# EAGLE schematic Projeto 2 (EAGLE 9.3.0)
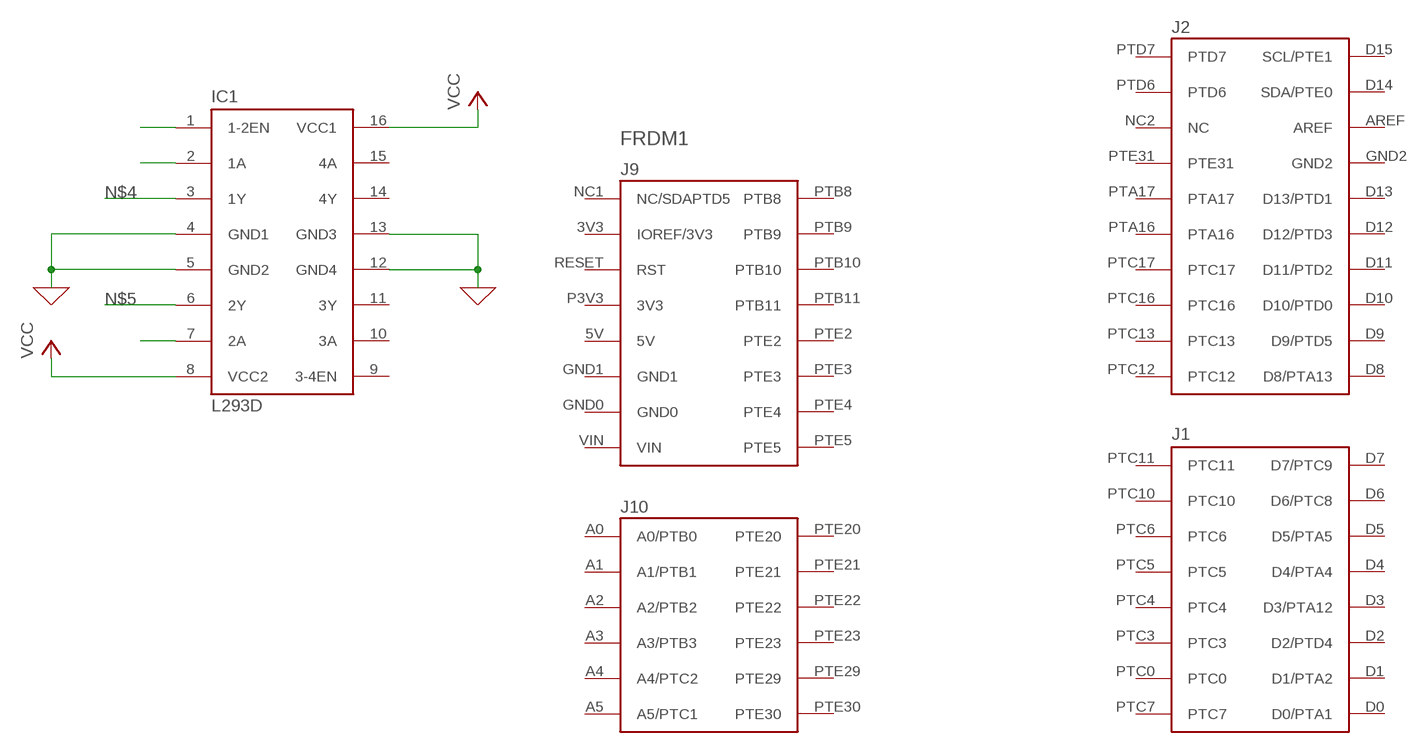
[diagram p0: schematic, sheet 1]

## Parts
FRDM1  FRDM-KL25ZNORMAL  [FRDM_KL25Z_NORMAL]
IC1  L293D  [DIL16]

## Nets
0: IC1.4(GND1) IC1.5(GND2) IC1.12(GND4) IC1.13(GND3) ; supply symbol labelled GND
N$1: IC1.2(1A)
N$2: IC1.7(2A)
N$3: IC1.1(1-2EN)
N$4: IC1.3(1Y)
N$5: IC1.6(2Y)
VCC: IC1.8(VCC2) IC1.16(VCC1)
Unconnected: FRDM1.3V3(IOREF/3V3) FRDM1.5V FRDM1.A0(A0/PTB0) FRDM1.A1(A1/PTB1) FRDM1.A2(A2/PTB2) FRDM1.A3(A3/PTB3) FRDM1.A4(A4/PTC2) FRDM1.A5(A5/PTC1) FRDM1.AREF FRDM1.D0(D0/PTA1) FRDM1.D1(D1/PTA2) FRDM1.D2(D2/PTD4) FRDM1.D3(D3/PTA12) FRDM1.D4(D4/PTA4) FRDM1.D5(D5/PTA5) FRDM1.D6(D6/PTC8) FRDM1.D7(D7/PTC9) FRDM1.D8(D8/PTA13) FRDM1.D9(D9/PTD5) FRDM1.D10(D10/PTD0) FRDM1.D11(D11/PTD2) FRDM1.D12(D12/PTD3) FRDM1.D13(D13/PTD1) FRDM1.D14(SDA/PTE0) FRDM1.D15(SCL/PTE1) FRDM1.GND0 FRDM1.GND1 FRDM1.GND2 FRDM1.NC1(NC/SDAPTD5) FRDM1.NC2(NC) FRDM1.P3V3(3V3) FRDM1.PTA16 FRDM1.PTA17 FRDM1.PTB8 FRDM1.PTB9 FRDM1.PTB10 FRDM1.PTB11 FRDM1.PTC0 FRDM1.PTC3 FRDM1.PTC4 FRDM1.PTC5 FRDM1.PTC6 FRDM1.PTC7 FRDM1.PTC10 FRDM1.PTC11 FRDM1.PTC12 FRDM1.PTC13 FRDM1.PTC16 FRDM1.PTC17 FRDM1.PTD6 FRDM1.PTD7 FRDM1.PTE2 FRDM1.PTE3 FRDM1.PTE4 FRDM1.PTE5 FRDM1.PTE20 FRDM1.PTE21 FRDM1.PTE22 FRDM1.PTE23 FRDM1.PTE29 FRDM1.PTE30 FRDM1.PTE31 FRDM1.RESET(RST) FRDM1.VIN IC1.9(3-4EN) IC1.10(3A) IC1.11(3Y) IC1.14(4Y) IC1.15(4A)

## Library data of the parts
FRDM1 = Freedom:FRDM-KL25Z: For creating FRDM-KL25Z shields
IC1 = st-microelectronics:L293D: PUSH-PULL 4 CHANNEL DRIVER; MPN: L293D; OC_FARNELL: 9589619; OC_NEWARK: 56P8249